# Altium schematic sheet RTC.SchDoc
size A4
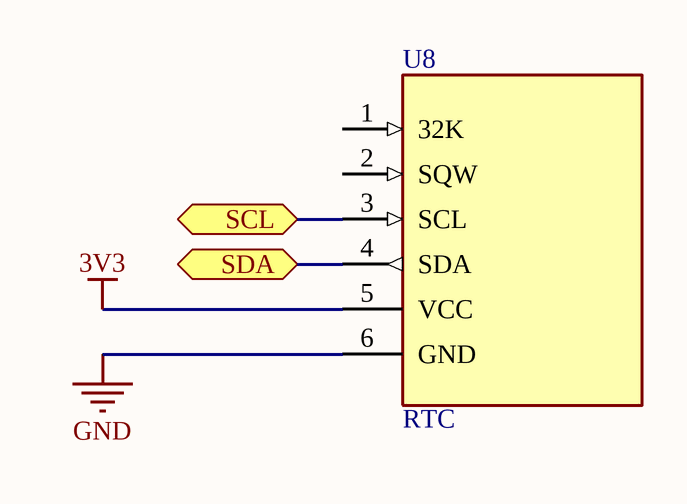
[diagram p0: RTC.SchDoc]

## Parts
U8  RTC  [DS3231]

## Ports
SCL (bidir), SDA (bidir)

## Nets
3V3: U8.5(VCC)
GND: U8.6(GND)
SCL: U8.3(SCL) ; port SCL
SDA: U8.4(SDA) ; port SDA

Not connected (* = marked no-connect by the designer): U8 1(32K) 2(SQW)

## Library data of the parts
U8 = DS3231